# EAGLE schematic file-1764160733451-121515755 (EAGLE 9.7.0)
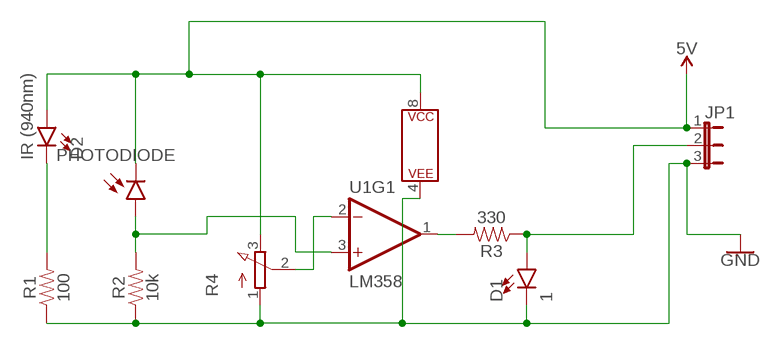
[diagram p0: schematic, sheet 1]

## Parts
D1  1  LED5MM  [LED_5MM]
D2  IR (940nm)  LED-IRTSAL6100  [LED_5MM]
D3  PHOTODIODE  [LEDRD254W51D580H541B]
JP1  JP2E  [JP2]
R1  100  RESISTORAXIAL-0.3  [AXIAL-0.3]
R2  10k  RESISTORAXIAL-0.3  [AXIAL-0.3]
R3  330  RESISTORAXIAL-0.3  [AXIAL-0.3]
R4  3RP/1610N  [3RP/1610N]
U1  LM358  [DIP08]

## Nets
5V: D2.A D3.C JP1.1 R4.3(E) U1.8(P$V+)
GND: D1.K(C) JP1.3 R1.P$1 R2.P$1 R4.1(A) U1.4(P$V-)
N$1: D2.K(C) R1.P$2
N$2: D3.A R2.P$2 U1.3(+IN)
N$3: R4.2(S) U1.2(-IN)
N$4: R3.P$2 U1.1(OUT)
N$5: D1.A JP1.2 R3.P$1
Unconnected: U1.5(+IN) U1.6(-IN) U1.7(OUT)

## Library data of the parts
D1 = SparkFun-LED:LED: LED (Generic) Standard schematic elements and footprints for 5mm, 3mm, 1206, and 0603 sized LEDs. Generic LEDs with no color specified.
D2 = SparkFun-LED:LED-IR: Infrared LED (IR) Wavelength: 940nm Packages: TSAL6100 LTE302 - Side firing. Check SparkFun-Sensors.lbr for the receiver SparkFun Products: ZX Distance and Gesture Sensor <[https://www.sparkfun.com/products/12780]> Infrared Emitters and Detectors <https://www.sparkfun.com/products/241>; PROD_ID: DIO-12058
D3 = Tinkercad:PHOTODIODE: Photodiode Reference Datasheet <https://datasheet.octopart.com/PDB-C139-Advanced-Photonix-datasheet-146011.pdf>
JP1 = jumper:JP2E: JUMPER
R1-R3 = SparkFun-Resistors:RESISTOR: Generic Resistor Package
R4 = pot:3RP/1610N: 16mm Potentiometer one level Source: http://www.alphapotentiometers.net/html/16mm_pot_2.html
U1 = SparkFun-IC-Amplifiers:LM358: LM358 Jellybean op-amp Datasheet <http://www.sparkfun.com/datasheets/Components/General/LM358.pdf> SparkFun Products Op-Amp (Thru-Hole) - LM358 <https://www.sparkfun.com/products/9456> (COM-09456); PROD_ID: IC-09172